# EAGLE design rpi_midi (EAGLE 6.3)
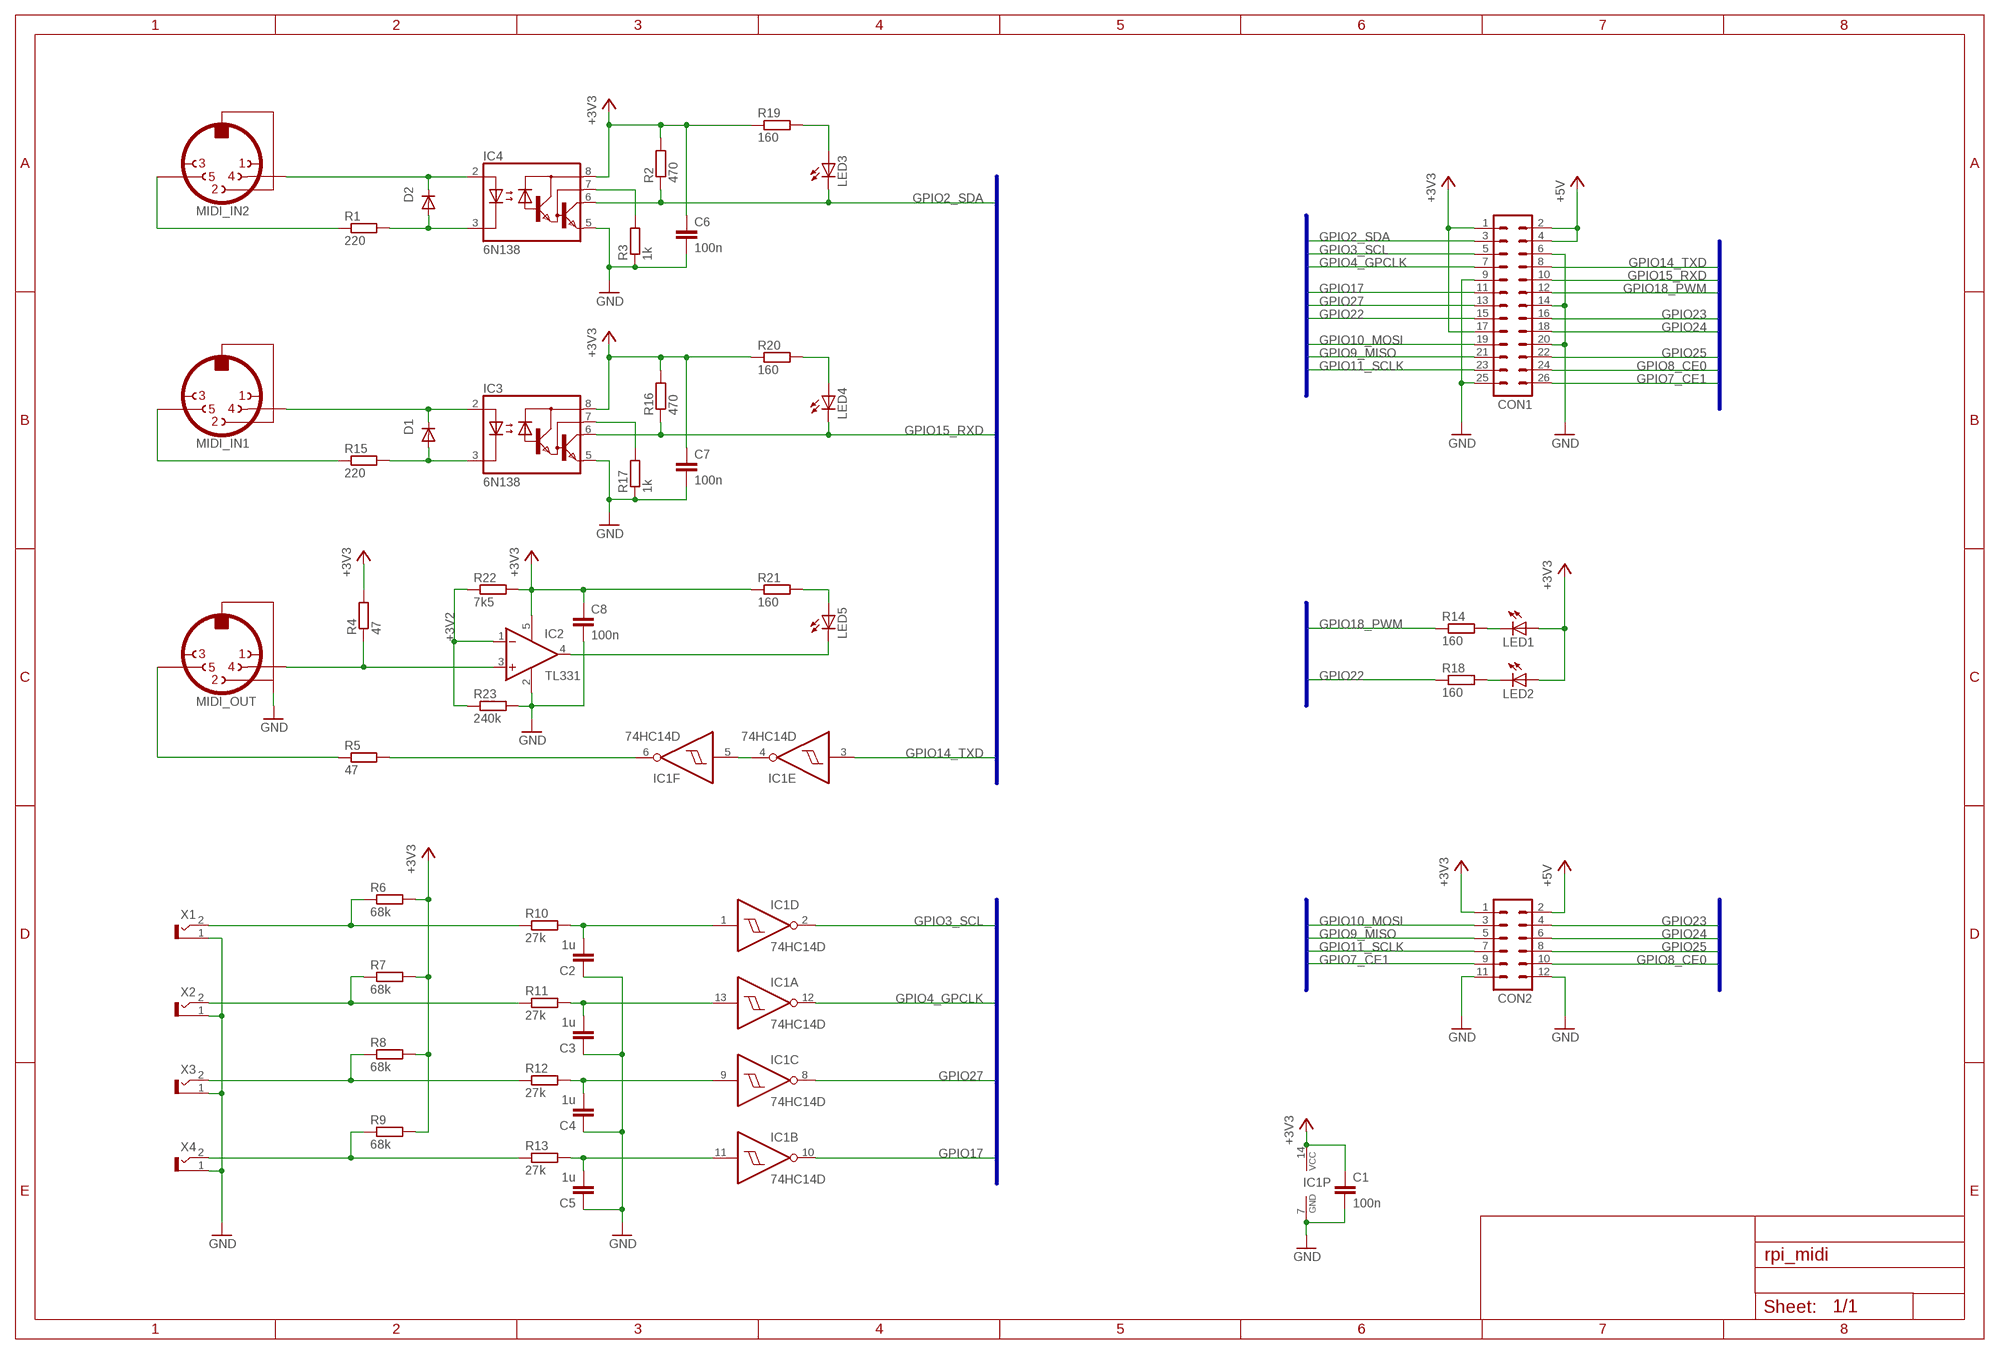
[diagram p0: schematic, sheet 1]

## Parts
C1  100n  C-EUC0603  [C0603]
C2  1u  C-EUC0603  [C0603]
C3  1u  C-EUC0603  [C0603]
C4  1u  C-EUC0603  [C0603]
C5  1u  C-EUC0603  [C0603]
C6  100n  C-EUC0603  [C0603]
C7  100n  C-EUC0603  [C0603]
C8  100n  C-EUC0603  [C0603]
CON1  MA13-2  [MA13-2]
CON2  MA06-2  [MA06-2]
D1  1N4148SOD-323  [SOD323-R]
D2  1N4148SOD-323  [SOD323-R]
IC1  74HC14D  [SO14]
IC2  TL331  [SOT23-DBV]
IC3  6N138  [DIL08]
IC4  6N138  [DIL08]
LED1  LED2.54MM  [HEADER_2X1]
LED2  LED2.54MM  [HEADER_2X1]
LED3  LED2.54MM  [HEADER_2X1]
LED4  LED2.54MM  [HEADER_2X1]
LED5  LED2.54MM  [HEADER_2X1]
MIDI_IN1  MIDI_2PIN  [HEADER_2X1]
MIDI_IN2  MIDI_2PIN  [HEADER_2X1]
MIDI_OUT  MIDI_3PIN  [HEADER_3X1]
R1  220  R-EU_R0603  [R0603]
R2  470  R-EU_R0603  [R0603]
R3  1k  R-EU_R0603  [R0603]
R4  47  R-EU_R0603  [R0603]
R5  47  R-EU_R0603  [R0603]
R6  68k  R-EU_R0603  [R0603]
R7  68k  R-EU_R0603  [R0603]
R8  68k  R-EU_R0603  [R0603]
R9  68k  R-EU_R0603  [R0603]
R10  27k  R-EU_R0603  [R0603]
R11  27k  R-EU_R0603  [R0603]
R12  27k  R-EU_R0603  [R0603]
R13  27k  R-EU_R0603  [R0603]
R14  160  R-EU_R0603  [R0603]
R15  220  R-EU_R0603  [R0603]
R16  470  R-EU_R0603  [R0603]
R17  1k  R-EU_R0603  [R0603]
R18  160  R-EU_R0603  [R0603]
R19  160  R-EU_R0603  [R0603]
R20  160  R-EU_R0603  [R0603]
R21  160  R-EU_R0603  [R0603]
R22  7k5  R-EU_R0603  [R0603]
R23  240k  R-EU_R0603  [R0603]
X1  WBTOR12.54MM  [HEADER_2X1]
X2  WBTOR12.54MM  [HEADER_2X1]
X3  WBTOR12.54MM  [HEADER_2X1]
X4  WBTOR12.54MM  [HEADER_2X1]

## Nets
+3V2: IC2.1(-IN) R22.1 R23.1
+3V3: C1.1 C6.1 C7.1 C8.1 CON1.1 CON1.17 CON2.1 IC1.14(P:VCC) IC2.5(V+) IC3.8(VCC) IC4.8(VCC) LED1.1(A) LED2.1(A) R2.2 R4.2 R6.2 R7.2 R8.2 R9.2 R16.2 R19.1 R20.1 R21.1 R22.2
+5V: CON1.2 CON1.4 CON2.2
GND: C1.2 C2.1 C3.1 C4.1 C5.1 C6.2 C7.2 C8.2 CON1.6 CON1.9 CON1.14 CON1.20 CON1.25 CON2.11 CON2.12 IC1.7(P:GND) IC2.2(V-) IC3.5(GND) IC4.5(GND) MIDI_OUT.3(PE) R3.1 R17.1 R23.2 X1.1(S) X2.1(S) X3.1(S) X4.1(S)
GPIO2_SDA: CON1.3 IC4.6(VO) LED3.2(C) R2.1
GPIO3_SCL: CON1.5 IC1.2(D:O)
GPIO4_GPCLK: CON1.7 IC1.12(A:O)
GPIO7_CE1: CON1.26 CON2.9
GPIO8_CE0: CON1.24 CON2.10
GPIO9_MISO: CON1.21 CON2.5
GPIO10_MOSI: CON1.19 CON2.3
GPIO11_SCLK: CON1.23 CON2.7
GPIO14_TXD: CON1.8 IC1.3(E:I)
GPIO15_RXD: CON1.10 IC3.6(VO) LED4.2(C) R16.1
GPIO17: CON1.11 IC1.10(B:O)
GPIO18_PWM: CON1.12 R14.1
GPIO22: CON1.15 R18.1
GPIO23: CON1.16 CON2.4
GPIO24: CON1.18 CON2.6
GPIO25: CON1.22 CON2.8
GPIO27: CON1.13 IC1.8(C:O)
N$1: MIDI_IN2.2 R1.1
N$2: D2.A IC4.3(C) R1.2
N$3: D2.C IC4.2(A) MIDI_IN2.1
N$4: LED1.2(C) R14.2
N$5: IC4.7(VB) R3.2
N$6: IC1.6(F:O) R5.2
N$7: LED2.2(C) R18.2
N$8: IC1.4(E:O) IC1.5(F:I)
N$9: MIDI_OUT.2 R5.1
N$10: IC2.3(+IN) MIDI_OUT.1 R4.1
N$11: MIDI_IN1.2 R15.1
N$12: R6.1 R10.1 X1.2(T)
N$13: C2.2 IC1.1(D:I) R10.2
N$14: R7.1 R11.1 X2.2(T)
N$15: R8.1 R12.1 X3.2(T)
N$16: R9.1 R13.1 X4.2(T)
N$17: C3.2 IC1.13(A:I) R11.2
N$18: C4.2 IC1.9(C:I) R12.2
N$19: C5.2 IC1.11(B:I) R13.2
N$20: D1.A IC3.3(C) R15.2
N$22: IC2.4(OUT) LED5.2(C)
N$23: LED5.1(A) R21.2
N$26: D1.C IC3.2(A) MIDI_IN1.1
N$28: IC3.7(VB) R17.2
N$29: LED3.1(A) R19.2
N$30: LED4.1(A) R20.2

## Buses
GPIO:GPIO2_SDA,GPIO3_SCL,GPIO4_GPCLK,GPIO7_CE1,GPIO8_CE0,GPIO9_MISO,GPIO10_MOSI,GPIO11_SCLK,GPIO14_TXD,GPIO15_RXD,GPIO17,GPIO18_PWM,GPIO22,GPIO23,GPIO24,GPIO25,GPIO27

## Library data of the parts
C1-C8 = rcl:C-EU: CAPACITOR, European symbol
CON1 = con-lstb:MA13-2: PIN HEADER; OC_FARNELL: unknown; OC_NEWARK: unknown
CON2 = con-lstb:MA06-2: PIN HEADER; OC_FARNELL: unknown; OC_NEWARK: unknown
D1 D2 = diode:1N4148: DIODE high speed (Philips)
IC1 = 74xx-eu:74*14: Hex schmitt trigger INVERTER
IC2 = custom:TL331
IC3 IC4 = optocoupler:6N138: MOTOROLA OPTO COUPLER; MF: VISHAY/TELEFUNKEN; MPN: 6N138; OC_FARNELL: 9860150; OC_NEWARK: 35K5294
LED1-LED5 = led:LED: LED OSRAM: - CHIPLED LG R971, LG N971, LY N971, LG Q971, LY Q971, LO R971, LY R971 LH N974, LH R974 LS Q976, LO Q976, LY Q976 LO Q996 - Hyper CHIPLED LW Q18S LB Q993, LB Q99A, LB R99A - SideLED LS A670, LO A670, LY A670, LG A670, LP A670 LB A673, LV A673, LT A673, LW A673 LH A674 LY A675 LS A676, LA A676, LO A676, LY A676, LW A676 LS A679, LY A679, LG A679 - Hyper Micro SIDELED® LS Y876, LA Y876, LO Y876, LY Y876 LT Y87S - SmartLED LW L88C, LW L88S LB L89C, LB L89S, LG L890 LS L89K, LO L89K, LY L89K LS L896, LA L896, LO L896, LY L896 - TOPLED LS T670, LO T670, LY T670, LG T670, LP T670 LSG T670, LSP T670, LSY T670, LOP T670, LYG T670 LG T671, LOG T671, LSG T671 LB T673, LV T673, LT T673, LW T673 LH T674 LS T676, LA T676, LO T676, LY T676, LB T676, LH T676, LSB T676, LW T676 LB T67C, LV T67C, LT T67C, LS T67K, LO T67K, LY T67K, LW E67C LS E67B, LA E67B, LO E67B, LY E67B, LB E67C, LV E67C, LT E67C LW T67C LS T679, LY T679, LG T679 LS T770, LO T770, LY T770, LG T770, LP T770 LB T773, LV T773, LT T773, LW T773 LH T774 LS E675, LA E675, LY E675, LS T675 LS T776, LA T776, LO T776, LY T776, LB T776 LHGB T686 LT T68C, LB T68C - Hyper Mini TOPLED® LB M676 - Mini TOPLED Santana® LG M470 LS M47K, LO M47K, LY M47K Source: http://www.osram.convergy.de LUXEON: - LUMILED® LXK2-PW12-R00, LXK2-PW12-S00, LXK2-PW14-U00, LXK2-PW14-V00 LXK2-PM12-R00, LXK2-PM12-S00, LXK2-PM14-U00 LXK2-PE12-Q00, LXK2-PE12-R00, LXK2-PE12-S00, LXK2-PE14-T00, LXK2-PE14-U00 LXK2-PB12-K00, LXK2-PB12-L00, LXK2-PB12-M00, LXK2-PB14-N00, LXK2-PB14-P00, LXK2-PB14-Q00 LXK2-PR12-L00, LXK2-PR12-M00, LXK2-PR14-Q00, LXK2-PR14-R00 LXK2-PD12-Q00, LXK2-PD12-R00, LXK2-PD12-S00 LXK2-PH12-R00, LXK2-PH12-S00 LXK2-PL12-P00, LXK2-PL12-Q00, LXK2-PL12-R00 Source: www.luxeon.com KINGBRIGHT: KA-3528ASYC Source: www.kingbright.com
MIDI_IN1 MIDI_IN2 = con-hirschmann:MIDI_2PIN
MIDI_OUT = con-hirschmann:MIDI_3PIN
R1-R23 = rcl:R-EU_: RESISTOR, European symbol
X1-X4 = con-lumberg:WBTOR1: RCA connectors according to JEITA RC-5231 Cinch RCA-Einbaukupplung nach JEITA RC-5231, abgewinkelte Ausführung Source: http://www.lumberg.de/Produkte/PDFs/WBTOR1.pdf

## Board
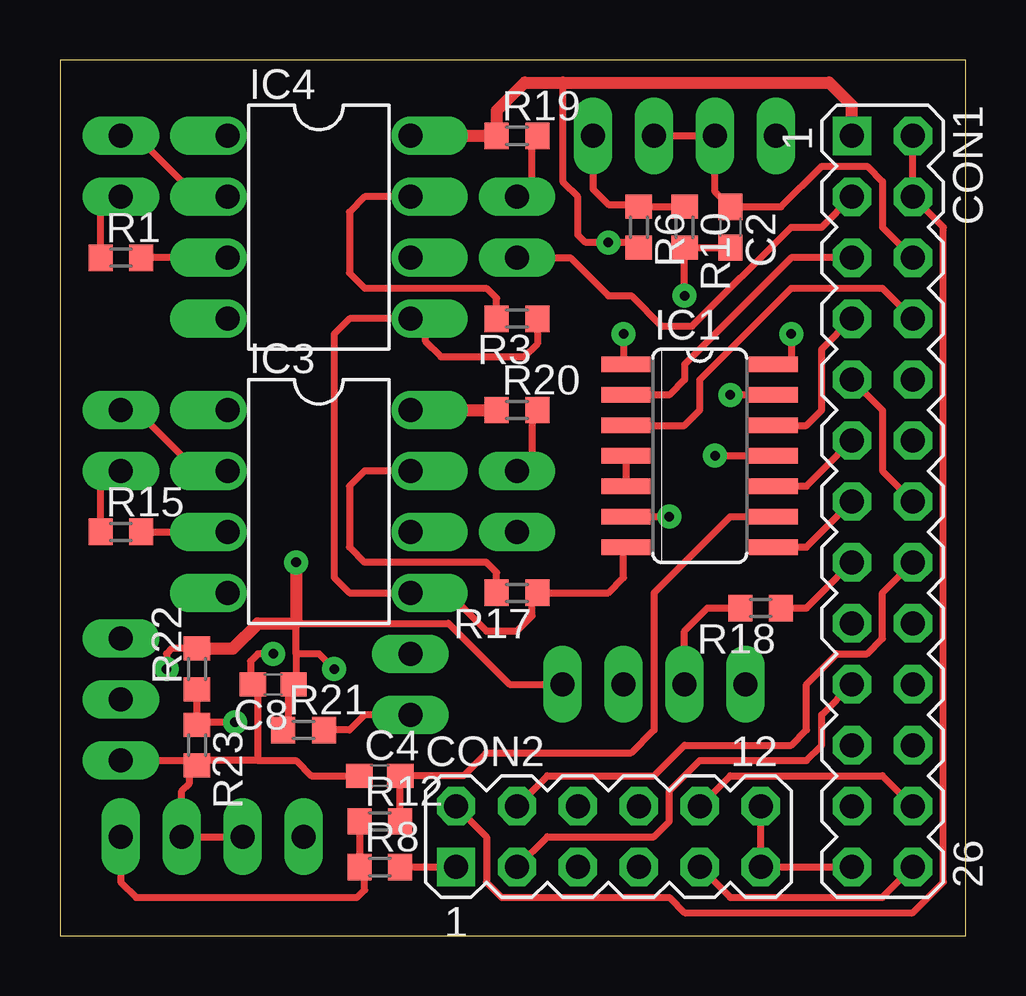
[diagram p1: board, top side]
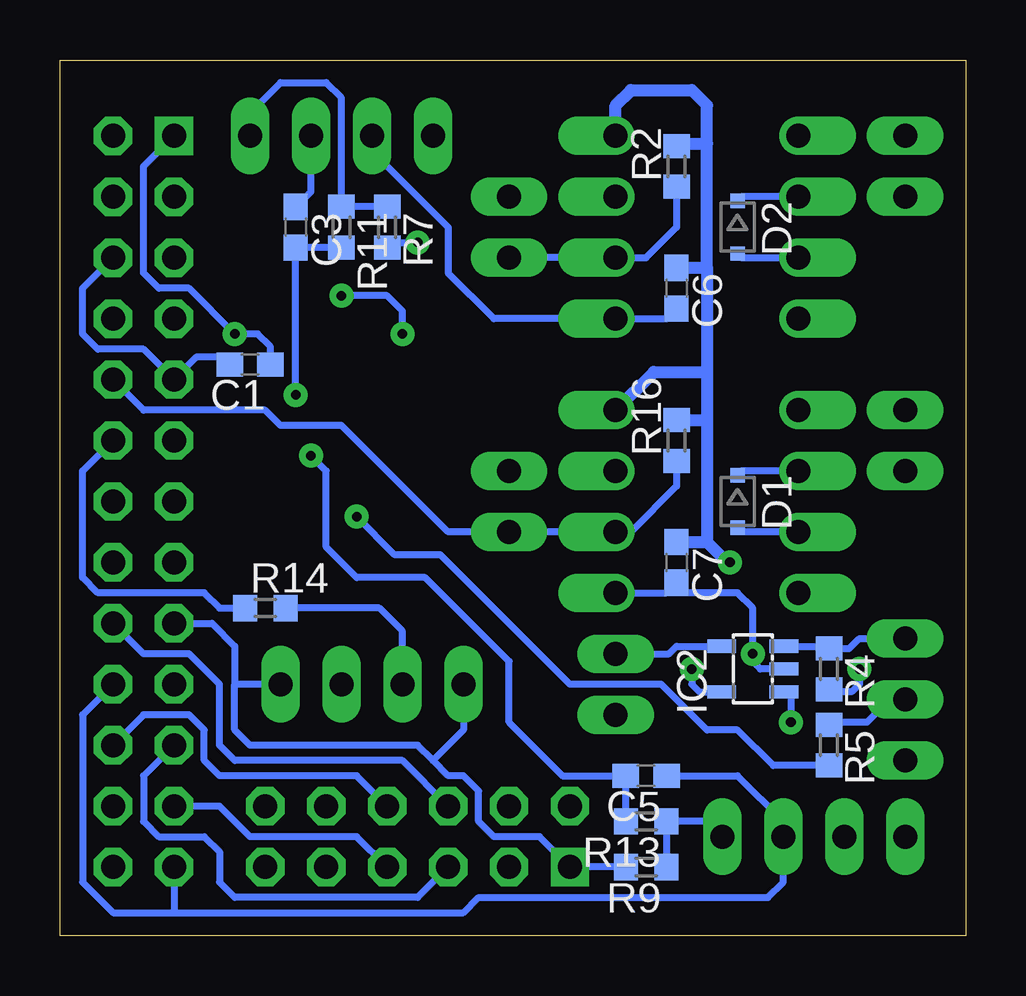
[diagram p2: board, bottom side, seen from below]

Size 37.77 x 36.5 mm. Coordinates in mm from the lower left corner, seen from the top.
Outline: 0,0 37.77,0 37.77,36.5 0,36.5 0,0
Copper layers (1*16): Top 0.035mm / dielectric 1.5mm / Bottom 0.035mm
Design rules "makepcb": minimum track width 0.2mm, minimum drill 0.3mm, track to track 0.2mm, track to pad 0.2mm, pad to pad 0.2mm, via to via 0.3mm, smd to smd 0.2mm, copper to edge 0.5mm, drill to drill 0.3mm, minimum pad ring 0.3mm, minimum via ring 0.3mm, stop-mask expansion 4mil, vias tented up to drill 0.6mm, thermal gap 10mil

### Footprints (pad centres in the part's own frame; a part is rotated, then mirrored left to right if it is on the bottom)
C0603 = smd 1.1 x 1: 1 -0.85,0; 2 0.85,0
MA13-2 = drill 1 square: 1 -15.24,-1.27 | drill 1 octagon: 2 -15.24,1.27; 3 -12.7,-1.27; 4 -12.7,1.27; 5 -10.16,-1.27; 6 -10.16,1.27; 7 -7.62,-1.27; 8 -7.62,1.27; 9 -5.08,-1.27; 10 -5.08,1.27; 11 -2.54,-1.27; 12 -2.54,1.27; 13 0,-1.27; 14 0,1.27; 15 2.54,-1.27; 16 2.54,1.27; 17 5.08,-1.27; 18 5.08,1.27; 19 7.62,-1.27; 20 7.62,1.27; 21 10.16,-1.27; 22 10.16,1.27; 23 12.7,-1.27; 24 12.7,1.27; 25 15.24,-1.27; 26 15.24,1.27
MA06-2 = drill 1 square: 1 -6.35,-1.27 | drill 1 octagon: 2 -6.35,1.27; 3 -3.81,-1.27; 4 -3.81,1.27; 5 -1.27,-1.27; 6 -1.27,1.27; 7 1.27,-1.27; 8 1.27,1.27; 9 3.81,-1.27; 10 3.81,1.27; 11 6.35,-1.27; 12 6.35,1.27
SOD323-R = smd 0.6 x 0.6: A 1.1,0; C -1.1,0
SO14 = smd 0.66 x 2.032: 1 -3.81,-3.073; 2 -2.54,-3.073; 3 -1.27,-3.073; 4 0,-3.073; 5 1.27,-3.073; 6 2.54,-3.073; 7 3.81,-3.073; 8 3.81,3.073; 9 2.54,3.073; 10 1.27,3.073; 11 0,3.073; 12 -1.27,3.073; 13 -2.54,3.073; 14 -3.81,3.073
SOT23-DBV = smd 0.55 x 1.2: 1 -0.95,-1.3; 2 0,-1.3; 3 0.95,-1.3; 4 0.95,1.3; 5 -0.95,1.3
DIL08 = drill 1 offset: 1 -3.81,-3.81; 2 -1.27,-3.81; 3 1.27,-3.81; 4 3.81,-3.81; 5 3.81,3.81; 6 1.27,3.81; 7 -1.27,3.81; 8 -3.81,3.81
HEADER_2X1 = drill 1 long: 1 -1.27,0; 2 1.27,0
HEADER_3X1 = drill 1 long: 1 -2.54,0; 2 0,0; 3 2.54,0
R0603 = smd 1 x 1.1: 1 -0.85,0; 2 0.85,0

### Placement (x,y rotation side)
C1  29.84,23.81 180 bottom
C2  27.94,29.53 270 top
C3  27.94,29.53 270 bottom
C4  13.34,6.67 0 top
C5  13.34,6.67 180 bottom
C6  12.06,26.99 270 bottom
C7  12.06,15.56 270 bottom
C8  8.89,10.48 180 top
CON1  34.29,18.1 270 top
CON2  22.86,4.13 0 top
D1  9.53,18.1 270 bottom
D2  9.53,29.53 270 bottom
IC1  26.67,20 270 top
IC2  8.89,11.11 90 bottom
IC3  10.79,18.1 270 top
IC4  10.79,29.53 270 top
LED1  22.23,10.48 0 top
LED2  27.3,10.48 180 top
LED3  19.05,29.53 270 top
LED4  19.05,18.1 270 top
LED5  14.61,10.48 90 top
MIDI_IN1  2.54,20.64 270 top
MIDI_IN2  2.54,32.07 270 top
MIDI_OUT  2.54,9.84 270 top
R1  2.54,28.26 0 top
R2  12.06,32.07 90 bottom
R3  19.05,25.72 180 top
R4  5.71,11.11 270 bottom
R5  5.71,7.94 270 bottom
R6  24.13,29.53 270 top
R7  24.13,29.53 270 bottom
R8  13.34,2.86 0 top
R9  13.34,2.86 180 bottom
R10  26.04,29.53 270 top
R11  26.04,29.53 270 bottom
R12  13.34,4.76 0 top
R13  13.34,4.76 180 bottom
R14  29.21,13.65 0 bottom
R15  2.54,16.83 0 top
R16  12.06,20.64 90 bottom
R17  19.05,14.29 180 top
R18  29.21,13.65 180 top
R19  19.05,33.34 0 top
R20  19.05,21.91 0 top
R21  10.16,8.57 0 top
R22  5.71,11.11 90 top
R23  5.71,7.94 270 top
X1  23.5,33.34 180 top
X2  28.57,33.34 0 top
X3  3.81,4.13 180 top
X4  8.89,4.13 0 top

### Tracks (layer width: path | path; a pad name or v marks a point on that pad's centre or on a via)
+3V2  (via drill 0.4)
  Top 0.3: R22.1 R23.1 5.71,8.89 v7.3,8.89
  Bottom 0.3: IC2.1 7.3,10.16 v7.3,8.89
+3V3  (via drill 0.4)
  Top 0.3: R9.2 CON2.1 | 20.95,35.56 20.95,31.43 21.59,30.8 21.59,29.21 21.91,28.89 v22.86,28.89 23.91,28.89 R7.2 | 29.84,23.91 IC1.14 30.48,23.81 v30.48,25.08 | R22.2 4.66,11.96 4.45,11.75 v4.45,11.11 | 9.53,8.89 9.31,8.89 R21.1 9.31,8.68 9.53,8.89 | 9.53,10.48 C8.1 9.84,10.58 9.84,10.79 | 9.84,11.75 9.84,10.79 | v11.43,11.11 10.79,11.75 9.84,11.75 | 9.53,8.89 9.53,10.48 | 9.53,10.48 9.84,10.79 | 9.84,11.75 9.84,13.02 16.19,13.02 18.73,10.48 LED1.1
  Top 0.5: IC4.8 R19.1 18.2,34.39 19.37,35.56 20.95,35.56 32.07,35.56 33.02,34.61 CON1.1 | IC3.8 R20.1 | R22.2 7.2,11.96 8.26,13.02 9.84,13.02 v9.84,15.56
  Bottom 0.3: R9.2 CON2.1 17.78,4.13 19.68,4.13 20.32,4.76 20.32,6.03 20.95,6.67 21.59,6.67 22.23,7.3 | 22.23,7.3 22.86,7.94 29.84,7.94 30.48,8.57 30.48,10.48 | R7.2 23.91,28.89 v22.86,28.89 | LED2.1 30.48,10.48 | LED1.1 20.95,8.57 22.23,7.3 | CON1.1 34.29,32.07 34.29,27.62 33.66,26.99 32.38,26.99 v30.48,25.08 29.53,25.08 29,24.55 C1.1 | CON1.17 31.43,13.02 30.48,12.06 30.48,10.48 | v4.45,11.11 4.45,10.48 4.76,10.16 5.61,10.16 R4.2 | v11.43,11.11 11.43,10.48 11.11,10.16 IC2.5 | 12.17,33.02 R2.2
  Bottom 0.5: 10.79,27.84 10.79,33.02 | 10.79,33.02 10.79,34.61 11.43,35.24 13.97,35.24 14.61,34.61 IC4.8 | 11.01,21.49 R16.2 10.9,21.49 10.79,21.59 | 10.79,27.84 10.79,23.5 | 10.79,23.5 10.79,21.59 | 10.79,21.59 10.79,16.41 | C7.1 10.79,16.41 | C6.1 10.79,27.84 | v9.84,15.56 9.95,15.56 10.79,16.41 | IC3.8 13.02,23.5 10.79,23.5 | 12.17,33.02 10.79,33.02
+5V
  Top 0.3: CON2.2 17.78,4.13 17.78,2.22 18.41,1.59 25.4,1.59 26.04,0.95 35.56,0.95 36.83,2.22 36.83,29.53 CON1.4 CON1.2
GND  (via drill 0.4)
  Top 0.3: R3.1 19.9,24.66 19.37,24.13 15.88,24.13 15.24,24.77 15.24,25.72 IC4.5 12.06,25.72 11.43,25.08 11.43,14.92 12.06,14.29 IC3.5 14.92,13.97 16.51,13.97 17.78,12.7 19.05,12.7 19.68,13.34 19.68,14.07 R17.1 | MIDI_OUT.3 5.71,7.3 | 5.71,7.3 R23.2 | 8.26,7.3 8.26,10.26 C8.2 7.94,10.58 7.94,11.43 8.26,11.75 v8.89,11.75 | 8.26,7.3 5.71,7.3 | X4.1 X3.1 5.08,6.03 5.4,6.35 5.4,6.67 R23.2 | X1.1 X2.1 27.3,31.01 C3.1 30.06,30.38 31.75,32.07 33.66,32.07 34.29,31.43 34.29,29.53 CON1.6 | CON1.25 CON2.11 CON2.12 | CON1.9 34.29,21.91 34.29,19.37 CON1.14 | R17.1 19.9,14.19 | 5.71,6.99 R23.2 | 8.26,7.3 9.84,7.3 10.48,6.67 C5.1 | R17.1 22.86,14.29 23.5,14.92 23.5,16.09 IC1.7
  Bottom 0.3: C6.2 12.48,25.72 IC4.5 19.68,25.72 21.59,27.62 21.59,29.53 24.77,32.7 X1.1 | IC3.5 12.48,14.29 C7.2 11.64,14.29 9.53,14.29 8.89,13.65 v8.89,11.75 8.89,11.43 8.57,11.11 IC2.2 | C5.1 9.53,6.67 7.62,4.76 X4.1 7.62,2.22 8.26,1.59 20.32,1.59 20.95,0.95 33.02,0.95 | C3.1 27.3,31.01 X2.1 | CON1.20 36.83,9.21 36.83,2.22 35.56,0.95 33.02,0.95 | CON1.25 33.02,0.95 | CON1.6 36.83,26.99 36.83,25.08 36.2,24.45 34.29,24.45 CON1.9 32.07,24.13 31.11,24.13 30.8,23.81 C1.2
GPIO2_SDA
  Top 0.3: CON1.3 31.75,29.53 30.48,29.53 26.35,25.4 25.08,25.4 23.81,26.67 22.86,26.67 21.27,28.26 LED3.2
  Bottom 0.3: R2.1 12.06,29.53 13.34,28.26 IC4.6 LED3.2
GPIO3_SCL
  Top 0.3: CON1.5 30.48,28.26 26.04,23.81 26.04,23.18 25.4,22.54 IC1.2
GPIO4_GPCLK
  Top 0.3: IC1.12 31.11,21.27 31.75,21.91 31.75,24.45 CON1.7
GPIO7_CE1
  Top 0.3: CON2.9 27.94,1.59 34.29,1.59 CON1.26
GPIO8_CE0
  Top 0.3: CON2.10 27.94,6.67 34.29,6.67 CON1.24
GPIO9_MISO
  Bottom 0.3: CON2.5 22.86,1.59 30.48,1.59 31.11,2.22 31.11,3.49 31.75,4.13 33.66,4.13 34.29,4.76 34.29,6.67 CON1.21
GPIO10_MOSI
  Top 0.3: CON2.3 20.32,4.13 24.77,4.13 25.4,4.76 25.4,6.03 26.67,7.3 31.11,7.3 31.75,7.94 31.75,9.21 CON1.19
GPIO11_SCLK
  Bottom 0.3: CON2.7 25.4,4.13 29.84,4.13 31.11,5.4 CON1.23
GPIO14_TXD
  Top 0.3: IC1.3 26.04,21.27 26.67,21.91 26.67,23.18 30.48,26.99 34.29,26.99 CON1.8
GPIO15_RXD
  Bottom 0.3: R16.1 12.06,18.73 13.97,16.83 IC3.6 LED4.2 21.59,16.83 26.04,21.27 28.57,21.27 29.21,21.91 34.29,21.91 CON1.10
GPIO17
  Top 0.3: IC1.10 31.11,18.73 CON1.11
GPIO18_PWM
  Bottom 0.3: CON1.12 36.83,19.37 36.83,14.92 36.2,14.29 31.75,14.29 31.11,13.65 R14.1
GPIO22
  Top 0.3: R18.1 31.11,13.65 CON1.15
GPIO23
  Top 0.3: CON2.4 20.32,6.67 24.77,6.67 26.04,7.94 30.48,7.94 31.11,8.57 31.11,10.48 32.38,11.75 33.66,11.75 34.29,12.38 34.29,14.29 CON1.16
GPIO24
  Bottom 0.3: CON1.18 34.29,11.75 32.38,11.75 31.11,10.48 31.11,7.94 30.48,7.3 23.5,7.3 CON2.6
GPIO25
  Bottom 0.3: CON2.8 25.4,6.67 31.11,6.67 31.75,7.3 31.75,8.57 32.38,9.21 34.29,9.21 CON1.22
GPIO27
  Top 0.3: IC1.8 31.11,16.19 CON1.13
N$1
  Top 0.3: R1.1 1.69,30.58 1.91,30.8 MIDI_IN2.2
N$2
  Top 0.3: IC4.3 R1.2
  Bottom 0.3: D2.A 9.36,28.26 IC4.3
N$3
  Top 0.3: MIDI_IN2.1 3.17,33.34 5.71,30.8 IC4.2
  Bottom 0.3: IC4.2 9.36,30.8 D2.C
N$4
  Bottom 0.3: LED1.2 23.5,12.7 24.45,13.65 R14.2
N$5
  Top 0.3: IC4.7 12.7,30.8 12.06,30.16 12.06,27.62 12.7,26.99 17.78,26.99 18.2,26.57 R3.2
N$6  (via drill 0.4)
  Top 0.3: IC1.6 v25.4,17.46
  Bottom 0.3: R5.2 8.04,7.09 9.53,8.57 10.79,8.57 12.7,10.48 16.51,10.48 21.91,15.88 23.81,15.88 v25.4,17.46
N$7
  Top 0.3: LED2.2 26.04,12.7 26.99,13.65 R18.2
N$8
  Top 0.3: IC1.4 IC1.5
N$9
  Bottom 0.3: MIDI_OUT.2 3.17,9.84 4.13,8.89 5.61,8.89 R5.1
N$10
  Bottom 0.3: IC2.3 5.82,12.06 R4.1 4.87,11.96 4.45,12.38 MIDI_OUT.1
N$11
  Top 0.3: R15.1 1.69,19.15 1.91,19.37 MIDI_IN1.2
N$12
  Top 0.3: R10.1 R6.1 24.03,30.48 22.86,30.48 22.23,31.11 X1.2
N$13  (via drill 0.4)
  Top 0.3: C2.2 R10.2 v26.04,26.67 | v23.5,25.08 23.5,23.81 IC1.1
  Bottom 0.3: v23.5,25.08 23.5,26.04 24.13,26.67 v26.04,26.67
N$14
  Bottom 0.3: R7.1 R11.1 26.04,34.92 26.67,35.56 28.57,35.56 29.84,34.29 X2.2
N$15
  Top 0.3: R12.1 R8.1 12.7,2.64 12.7,1.91 12.38,1.59 3.17,1.59 2.54,2.22 X3.2
N$16
  Bottom 0.3: X4.2 10.79,4.76 R13.1 R9.1
N$17  (via drill 0.4)
  Top 0.3: IC1.13 v27.94,22.54
  Bottom 0.3: R11.2 C3.2 v27.94,22.54
N$18
  Top 0.3: R12.2 C4.2 16.83,6.67 17.78,7.62 23.81,7.62 24.77,8.57 24.77,14.29 27.94,17.46 IC1.9
N$19  (via drill 0.4)
  Top 0.3: v27.3,20 IC1.11
  Bottom 0.3: R13.2 C5.2 16.83,6.67 19.05,8.89 19.05,11.43 22.54,14.92 25.4,14.92 26.67,16.19 26.67,19.37 v27.3,20
N$20
  Top 0.3: R15.2 IC3.3
  Bottom 0.3: IC3.3 9.36,16.83 D1.A
N$22
  Bottom 0.3: LED5.2 12.38,11.75 12.06,12.06 IC2.4
N$23
  Top 0.3: LED5.1 12.7,9.21 12.06,8.57 R21.2
N$26
  Top 0.3: MIDI_IN1.1 3.17,21.91 5.71,19.37 IC3.2
  Bottom 0.3: IC3.2 9.36,19.37 D1.C
N$28
  Top 0.3: IC3.7 12.7,19.37 12.06,18.73 12.06,16.19 12.7,15.56 17.78,15.56 18.2,15.14 R17.2
N$29
  Top 0.3: LED3.1 19.37,30.8 19.68,31.11 19.68,33.12 R19.2
N$30
  Top 0.3: R20.2 19.68,21.91 19.68,19.37 LED4.1

### Text on the board
tUserSilk: IN2 | 1 | S1 | S2 | MiDiPi | IN1 | OUT | v1.0 | L2 | L1 | FS/RS/DS | S3 | S4 | 1